# Altium schematic sheet 1.1.4_Interface_board_USB&XBee&RS232.SchDoc
size A4; DocumentNumber: 6; SheetNumber: 6; SheetTotal: 14
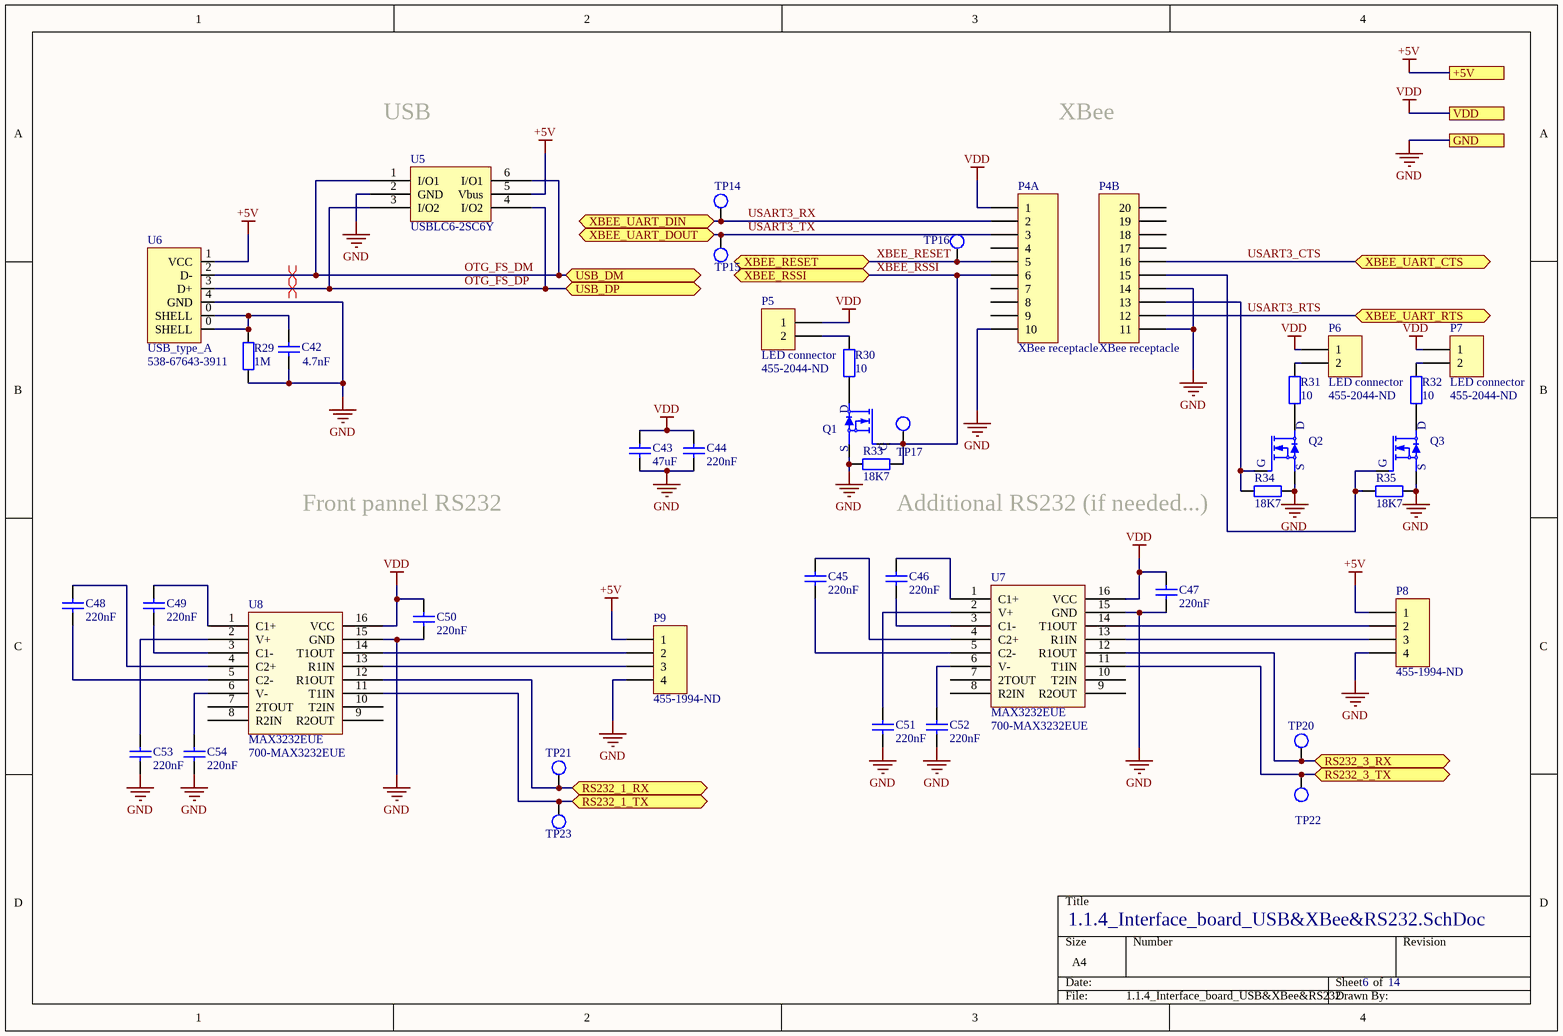
[diagram p0: 1.1.4_Interface_board_USB&XBee&RS232.SchDoc]

## Parts
C42  4.7nF  [CAP0603R]
C43  47uF  [CAP1206W]
C44  220nF  [CAP0603R]
C45  220nF  [CAP0603R]
C46  220nF  [CAP0603R]
C47  220nF  [CAP0603R]
C48  220nF  [CAP0603R]
C49  220nF  [CAP0603R]
C50  220nF  [CAP0603R]
C51  220nF  [CAP0603R]
C52  220nF  [CAP0603R]
C53  220nF  [CAP0603R]
C54  220nF  [CAP0603R]
P4  XBee receptacle  [XBee receptacle]  (parts A,B of 2)
P5  LED connector  Supplier Part Number 1: 455-2044-ND  [CON_JST_XA_ S02B-XASS-1]
P6  LED connector  Supplier Part Number 1: 455-2044-ND  [CON_JST_XA_ S02B-XASS-1]
P7  LED connector  Supplier Part Number 1: 455-2044-ND  [CON_JST_XA_ S02B-XASS-1]
P8  Supplier Part Number 1: 455-1994-ND  [CON_JST_XA_ B04B-XASK]  (hidden comment: Header 4p JST XA 3A)
P9  Supplier Part Number 1: 455-1994-ND  [CON_JST_XA_ B04B-XASK]  (hidden comment: Header 4p JST XA 3A)
Q1  MOSFET_N  [SOT-323-3]  (value not drawn)
Q2  MOSFET_N  [SOT-323-3]  (value not drawn)
Q3  MOSFET_N  [SOT-323-3]  (value not drawn)
R29  1M  [0603]
R30  10  [0603]
R31  10  [0603]
R32  10  [0603]
R33  18K7  [0603]
R34  18K7  [0603]
R35  18K7  [0603]
TP14  Test point  [TP]  (value not drawn)
TP15  Test point  [TP]  (value not drawn)
TP16  Test point  [TP]  (value not drawn)
TP17  Test point  [TP]  (value not drawn)
TP20  Test point  [TP]  (value not drawn)
TP21  Test point  [TP]  (value not drawn)
TP22  Test point  [TP]  (value not drawn)
TP23  Test point  [TP]  (value not drawn)
U5  USBLC6-2SC6Y  [SOT23-6L]
U6  USB_type_A  Supplier Part Number 1: 538-67643-3911  [USB type A Right angle]
U7  MAX3232EUE  Supplier Part Number 1: 700-MAX3232EUE  [TSSOP 16]
U8  MAX3232EUE  Supplier Part Number 1: 700-MAX3232EUE  [TSSOP 16]

## Ports
+5V, GND, RS232_1_RX (bidir), RS232_1_TX (bidir), RS232_3_RX (bidir), RS232_3_TX (bidir), USB_DM (bidir), USB_DP (bidir), VDD, XBEE_RESET (bidir), XBEE_RSSI (bidir), XBEE_UART_CTS (bidir), XBEE_UART_DIN (bidir), XBEE_UART_DOUT (bidir), XBEE_UART_RTS (bidir)

## Nets
+5V: P8.1 P9.1 U5.5(Vbus) U6.1(VCC) ; port +5V
GND: C42.1 C43.1 C44.1 C47.1 C50.1 C51.1 C52.1 C53.1 C54.1 P4.10 P4.11 P4.14 P8.4 P9.4 Q1.2(S) Q2.2(S) Q3.2(S) R29.1 R33.2 R34.1 R35.1 U5.2(GND) U6.4(GND) U7.15(GND) U8.15(GND) ; port GND
VDD: C43.2 C44.2 C47.2 C50.2 P4.1 P5.1 P6.1 P7.1 U7.16(VCC) U8.16(VCC) ; port VDD
OTG_FS_DM: U5.1(I/O1) U5.6(I/O1) U6.2(D-) ; port USB_DM
OTG_FS_DP: U5.3(I/O2) U5.4(I/O2) U6.3(D+) ; port USB_DP
RS232_1_RX: TP21.1 U8.12(R1OUT) ; port RS232_1_RX
RS232_1_TX: TP23.1 U8.11(T1IN) ; port RS232_1_TX
RS232_3_RX: TP20.1 U7.12(R1OUT) ; port RS232_3_RX
RS232_3_TX: TP22.1 U7.11(T1IN) ; port RS232_3_TX
USART3_CTS: P4.16 ; port XBEE_UART_CTS
USART3_RTS: P4.12 ; port XBEE_UART_RTS
USART3_RX: P4.2 TP14.1 ; port XBEE_UART_DIN
USART3_TX: P4.3 TP15.1 ; port XBEE_UART_DOUT
XBEE_RESET: P4.5 TP16.1 ; port XBEE_RESET
XBEE_RSSI: P4.6 Q1.1(G) R33.1 TP17.1 ; port XBEE_RSSI
NetC42_2: C42.2 R29.2 U6.0(SHELL)
NetC45_1: C45.1 U7.5(C2-)
NetC45_2: C45.2 U7.4(C2+)
NetC46_1: C46.1 U7.3(C1-)
NetC46_2: C46.2 U7.1(C1+)
NetC48_1: C48.1 U8.5(C2-)
NetC48_2: C48.2 U8.4(C2+)
NetC49_1: C49.1 U8.3(C1-)
NetC49_2: C49.2 U8.1(C1+)
NetC51_2: C51.2 U7.2(V+)
NetC52_2: C52.2 U7.6(V-)
NetC53_2: C53.2 U8.2(V+)
NetC54_2: C54.2 U8.6(V-)
NetP4_13: P4.13 Q2.1(G) R34.2
NetP4_15: P4.15 Q3.1(G) R35.2
NetP5_2: P5.2 R30.2
NetP6_2: P6.2 R31.2
NetP7_2: P7.2 R32.2
NetP8_2: P8.2 U7.14(T1OUT)
NetP8_3: P8.3 U7.13(R1IN)
NetP9_2: P9.2 U8.14(T1OUT)
NetP9_3: P9.3 U8.13(R1IN)
NetQ1_3: Q1.3(D) R30.1
NetQ2_3: Q2.3(D) R31.1
NetQ3_3: Q3.3(D) R32.1

Not connected (* = marked no-connect by the designer): P4 4 7 8 9 17 18 19 20; U7 7(2TOUT) 8(R2IN) 9(R2OUT) 10(T2IN); U8 7(2TOUT) 8(R2IN) 9(R2OUT) 10(T2IN)

## Layout directives
differential pair: OTG_FS_DM, OTG_FS_DP

## Notes on the sheet
- USB
- XBee
- Front pannel RS232
- (near R34) Additional RS232 (if needed...)

## Library data of the parts
C42 = C_4.7nF: Capacitor; Supplier 1: Mouser; Supplier Part Number 1: 81-GCG188R92A472KA1D
C43 = C_47uF_25v_1206: Capacitor; Supplier 1: Mouser; Supplier Part Number 1: 810-C3216X5R1E476M
C44-C54 = C_220nF: Capacitor; Supplier 1: Mouser; Supplier Part Number 1: 81-GCG188R91H224KA1D
P5-P7 = Header 2p JST XA 3A right angle: Supplier 1: Digi-Key
Q1-Q3 = MOSFET_N_ 20V_1.4A: MOSFET N-Ch 20V 1.4A SOT-323-3; Supplier 1: Mouser; Supplier Part Number 1: 726-SP000917562
R29 = R_0603_01W_1M: 0.1W 1M; Supplier 1: Mouser; Supplier Part Number 1: 667-ERJ-3GEYJ105V
R30-R32 = R_0603_025W_10Ohm: 0.25W 10Ohm; Supplier 1: Mouser; Supplier Part Number 1: 667-ERJ-PA3J100V
R33-R35 = R_0603_01W_18K7: 0.1W 18K7; Supplier 1: Mouser; Supplier Part Number 1: 667-ERJ-3EKF1872V
U5 = USBLC6-2SC6Y: ESD Suppressors; Supplier 1: Mouser; Supplier Part Number 1: 511-USBLC6-2SC6Y
U6 = USB_type_A: USB type A; Supplier 1: Mouser
U7 U8 = MAX3232EUE: RS-232 Interface IC 3-5.5V 235kbps Transceiver; Supplier 1: Mouser
P4 = XBee receptacle: Supplier 1: Mouser; Supplier Part Number 1: 855-M22-7131042
P8 P9 = Header 4p JST XA 3A: Supplier 1: Digi-Key